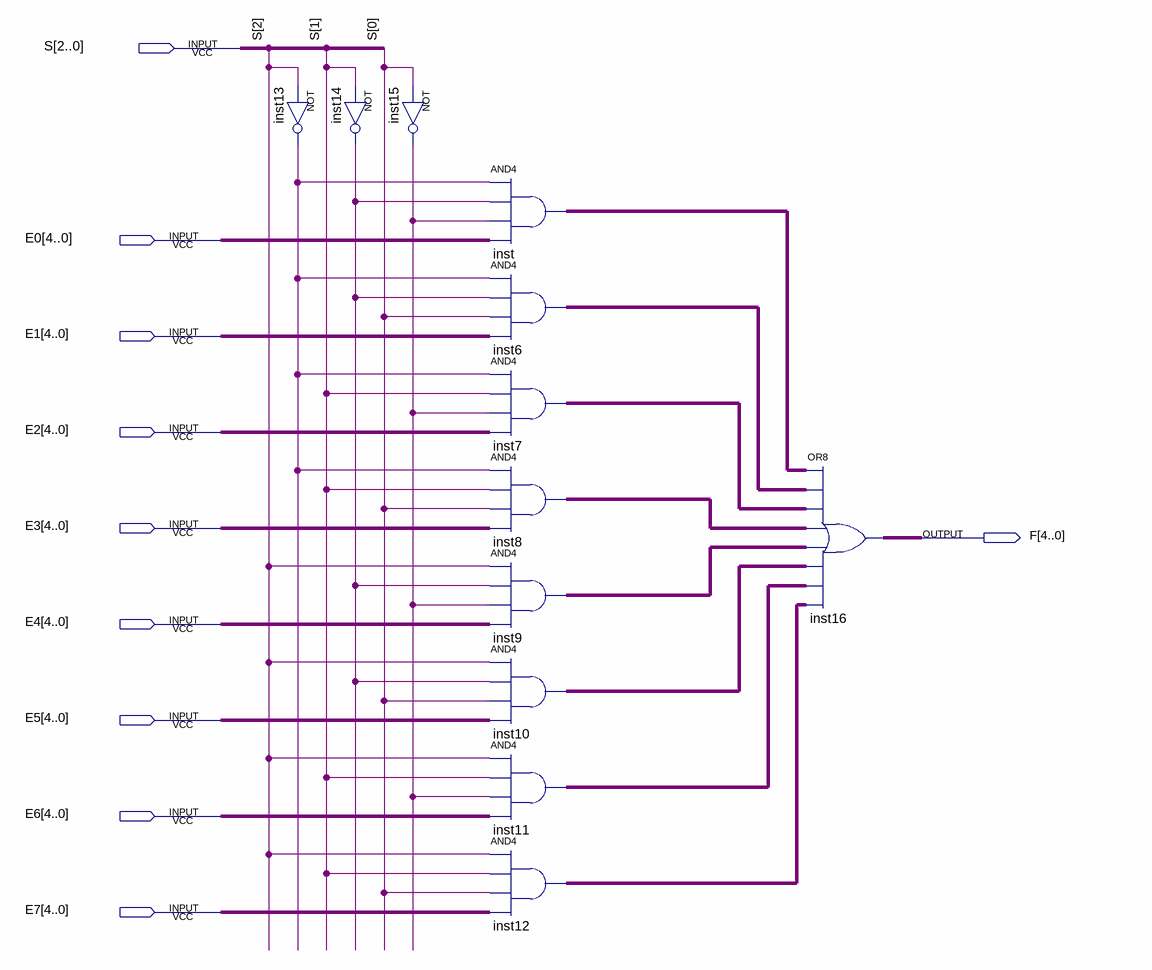
[diagram p0: schematic sheet]
// Quartus schematic mux_8x1_5bits.bdf as structural Verilog: 12 symbols, 10 pins
module mux_8x1_5bits (
  input  [2:0] S,
  input  [4:0] E0,
  input  [4:0] E1,
  input  [4:0] E2,
  input  [4:0] E3,
  input  [4:0] E4,
  input  [4:0] E5,
  input  [4:0] E6,
  input  [4:0] E7,
  output [4:0] F
);

  wire inst13_out, inst14_out, inst15_out;
  wire [4:0] inst6_out, inst7_out, inst8_out, inst9_out, inst10_out, inst11_out, inst12_out, inst_out;

  not inst13 (inst13_out, S[2]);
  not inst14 (inst14_out, S[1]);
  not inst15 (inst15_out, S[0]);
  assign inst_out = {5{inst13_out}} & {5{inst14_out}} & {5{inst15_out}} & E0;  // AND4 inst, 5 bits wide
  assign inst6_out = {5{inst13_out}} & {5{inst14_out}} & {5{S[0]}} & E1;  // AND4 inst6, 5 bits wide
  assign inst7_out = {5{inst13_out}} & {5{S[1]}} & {5{inst15_out}} & E2;  // AND4 inst7, 5 bits wide
  assign inst8_out = {5{inst13_out}} & {5{S[1]}} & {5{S[0]}} & E3;  // AND4 inst8, 5 bits wide
  assign inst9_out = {5{S[2]}} & {5{inst14_out}} & {5{inst15_out}} & E4;  // AND4 inst9, 5 bits wide
  assign inst10_out = {5{S[2]}} & {5{inst14_out}} & {5{S[0]}} & E5;  // AND4 inst10, 5 bits wide
  assign inst11_out = {5{S[2]}} & {5{S[1]}} & {5{inst15_out}} & E6;  // AND4 inst11, 5 bits wide
  assign inst12_out = {5{S[2]}} & {5{S[1]}} & {5{S[0]}} & E7;  // AND4 inst12, 5 bits wide
  assign F = inst_out | inst6_out | inst7_out | inst8_out | inst9_out | inst10_out | inst11_out | inst12_out;  // OR8 inst16, 5 bits wide
endmodule
